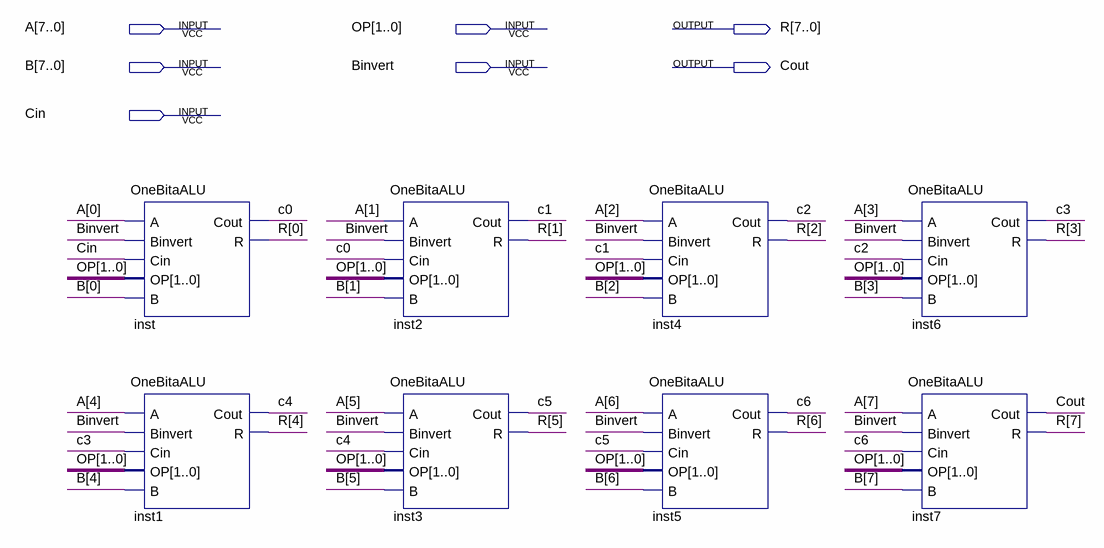
[diagram p0: schematic sheet]
// Quartus schematic EightBitALU.bdf as structural Verilog: 8 symbols, 7 pins
module EightBitALU (
  input  [7:0] A,
  input  [1:0] OP,
  input  [7:0] B,
  input  Binvert,
  input  Cin,
  output [7:0] R,
  output Cout
);

  wire c0, c1, c2, c3, c4, c5, c6;

  OneBitaALU inst (.A(A[0]), .Binvert(Binvert), .Cin(Cin), .OP(OP), .B(B[0]), .Cout(c0), .R(R[0]));
  OneBitaALU inst1 (.A(A[4]), .Binvert(Binvert), .Cin(c3), .OP(OP), .B(B[4]), .Cout(c4), .R(R[4]));
  OneBitaALU inst2 (.A(A[1]), .Binvert(Binvert), .Cin(c0), .OP(OP), .B(B[1]), .Cout(c1), .R(R[1]));
  OneBitaALU inst3 (.A(A[5]), .Binvert(Binvert), .Cin(c4), .OP(OP), .B(B[5]), .Cout(c5), .R(R[5]));
  OneBitaALU inst4 (.A(A[2]), .Binvert(Binvert), .Cin(c1), .OP(OP), .B(B[2]), .Cout(c2), .R(R[2]));
  OneBitaALU inst5 (.A(A[6]), .Binvert(Binvert), .Cin(c5), .OP(OP), .B(B[6]), .Cout(c6), .R(R[6]));
  OneBitaALU inst6 (.A(A[3]), .Binvert(Binvert), .Cin(c2), .OP(OP), .B(B[3]), .Cout(c3), .R(R[3]));
  OneBitaALU inst7 (.A(A[7]), .Binvert(Binvert), .Cin(c6), .OP(OP), .B(B[7]), .Cout(Cout), .R(R[7]));
endmodule
